# Altium project UNReLo End Node.PrjPcb (part 2 of 2)
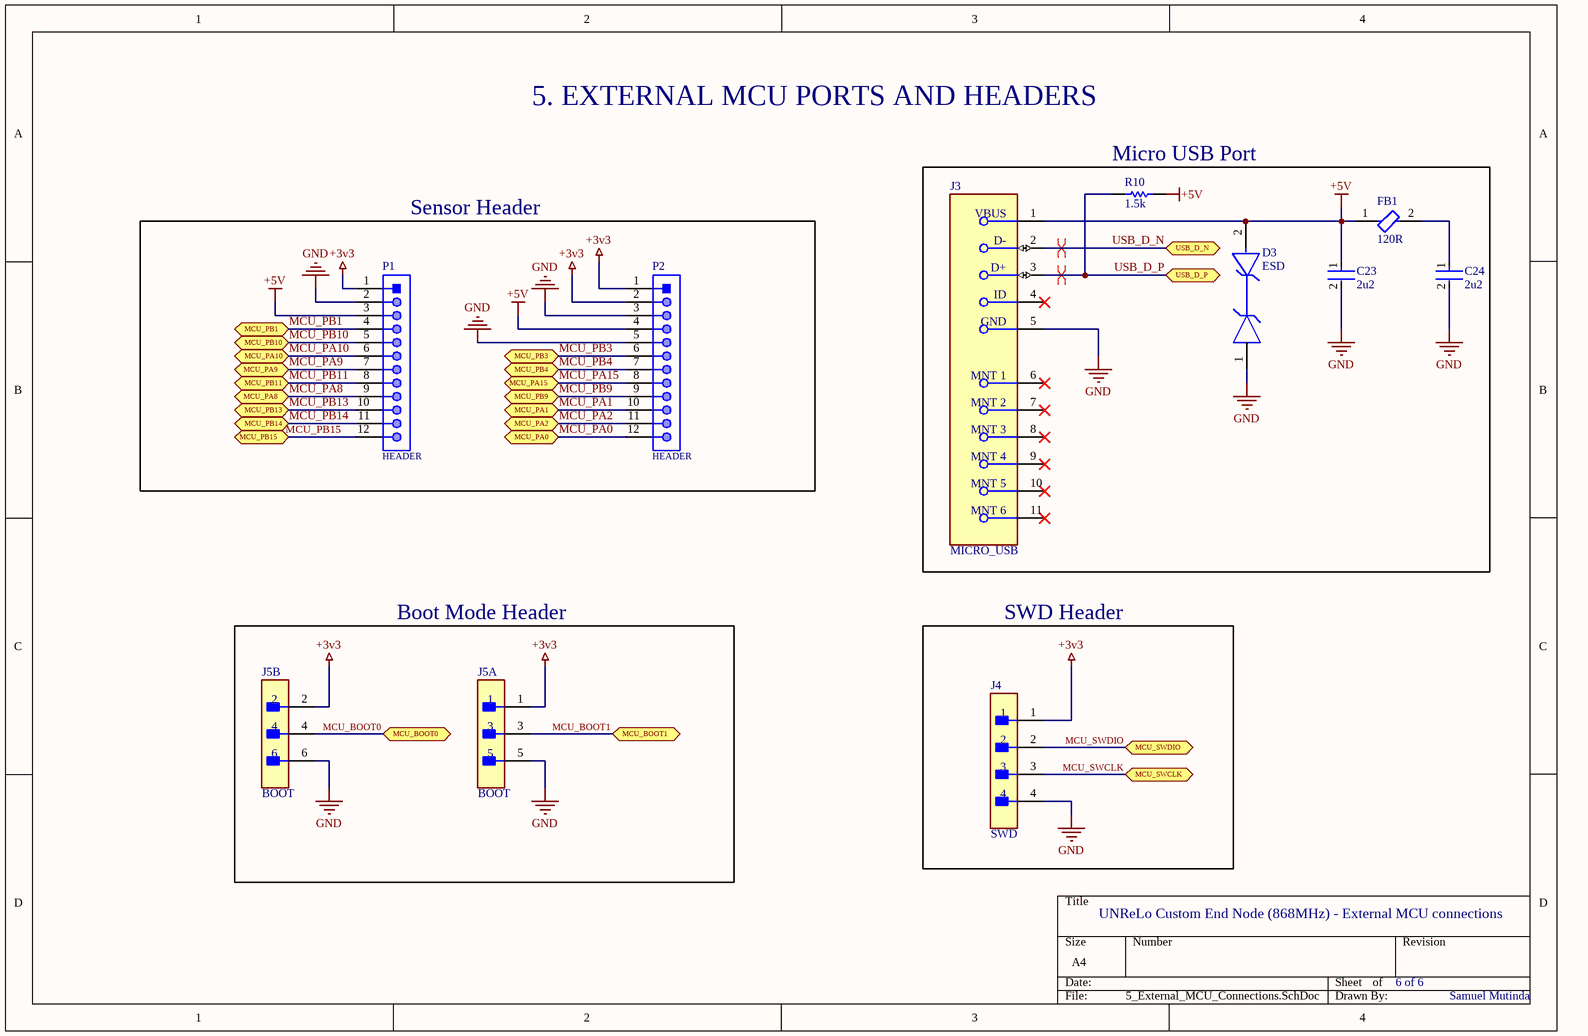
[diagram p6: 5_External_MCU_Connections.SchDoc]

## Nets that join several sheets
+3v3: 1_Power (5 pins), 2_MCU (14 pins), 3_IMU (5 pins), 4_RFM95W (MD1.13), 5_External_MCU_Connections (6 pins)
+5V: 1_Power (C1.1 J1.1 U1.1 U1.3), 5_External_MCU_Connections (7 pins)
GND: 1_Power (7 pins), 2_MCU (15 pins), 3_IMU (9 pins), 4_RFM95W (11 pins), 5_External_MCU_Connections (10 pins)
IMU_INT: 2_MCU (U2.45), 3_IMU (U3.12)
IMU_SCL: 2_MCU (R8.1 U2.42), 3_IMU (U3.23)
IMU_SDA: 2_MCU (R9.1 U2.43), 3_IMU (U3.24)
MCU_BOOT0: 2_MCU (R5.2), 5_External_MCU_Connections (J5.4)
MCU_BOOT1: 2_MCU (R6.2), 5_External_MCU_Connections (J5.3)
MCU_PA0: 2_MCU (U2.10), 5_External_MCU_Connections (P2.12)
MCU_PA1: 2_MCU (U2.11), 5_External_MCU_Connections (P2.10)
MCU_PA2: 2_MCU (U2.12), 5_External_MCU_Connections (P2.11)
MCU_PA8: 2_MCU (U2.29), 5_External_MCU_Connections (P1.9)
MCU_PA9: 2_MCU (U2.30), 5_External_MCU_Connections (P1.7)
MCU_PA10: 2_MCU (U2.31), 5_External_MCU_Connections (P1.6)
MCU_PA15: 2_MCU (U2.38), 5_External_MCU_Connections (P2.8)
MCU_PB1: 2_MCU (U2.19), 5_External_MCU_Connections (P1.4)
MCU_PB3: 2_MCU (U2.39), 5_External_MCU_Connections (P2.6)
MCU_PB4: 2_MCU (U2.40), 5_External_MCU_Connections (P2.7)
MCU_PB9: 2_MCU (U2.46), 5_External_MCU_Connections (P2.9)
MCU_PB10: 2_MCU (U2.21), 5_External_MCU_Connections (P1.5)
MCU_PB11: 2_MCU (U2.22), 5_External_MCU_Connections (P1.8)
MCU_PB13: 2_MCU (U2.26), 5_External_MCU_Connections (P1.10)
MCU_PB14: 2_MCU (U2.27), 5_External_MCU_Connections (P1.11)
MCU_PB15: 2_MCU (U2.28), 5_External_MCU_Connections (P1.12)
MCU_SWCLK: 2_MCU (U2.37), 5_External_MCU_Connections (J4.3)
MCU_SWDIO: 2_MCU (U2.34), 5_External_MCU_Connections (J4.2)
RFM_DIO0: 2_MCU (U2.13), 4_RFM95W (MD1.14)
RFM_DIO1: 2_MCU (U2.41), 4_RFM95W (MD1.15)
RFM_MISO: 2_MCU (U2.16), 4_RFM95W (MD1.2)
RFM_MOSI: 2_MCU (U2.17), 4_RFM95W (MD1.3)
RFM_NSS: 2_MCU (U2.14), 4_RFM95W (MD1.5)
RFM_RST: 2_MCU (U2.18), 4_RFM95W (MD1.6)
RFM_SCK: 2_MCU (U2.15), 4_RFM95W (MD1.4)
USB_D_N: 2_MCU (U2.32), 5_External_MCU_Connections (J3.2)
USB_D_P: 2_MCU (U2.33), 5_External_MCU_Connections (J3.3 R10.1)